# EAGLE design r8_ATMega328 (EAGLE 7.4.0)
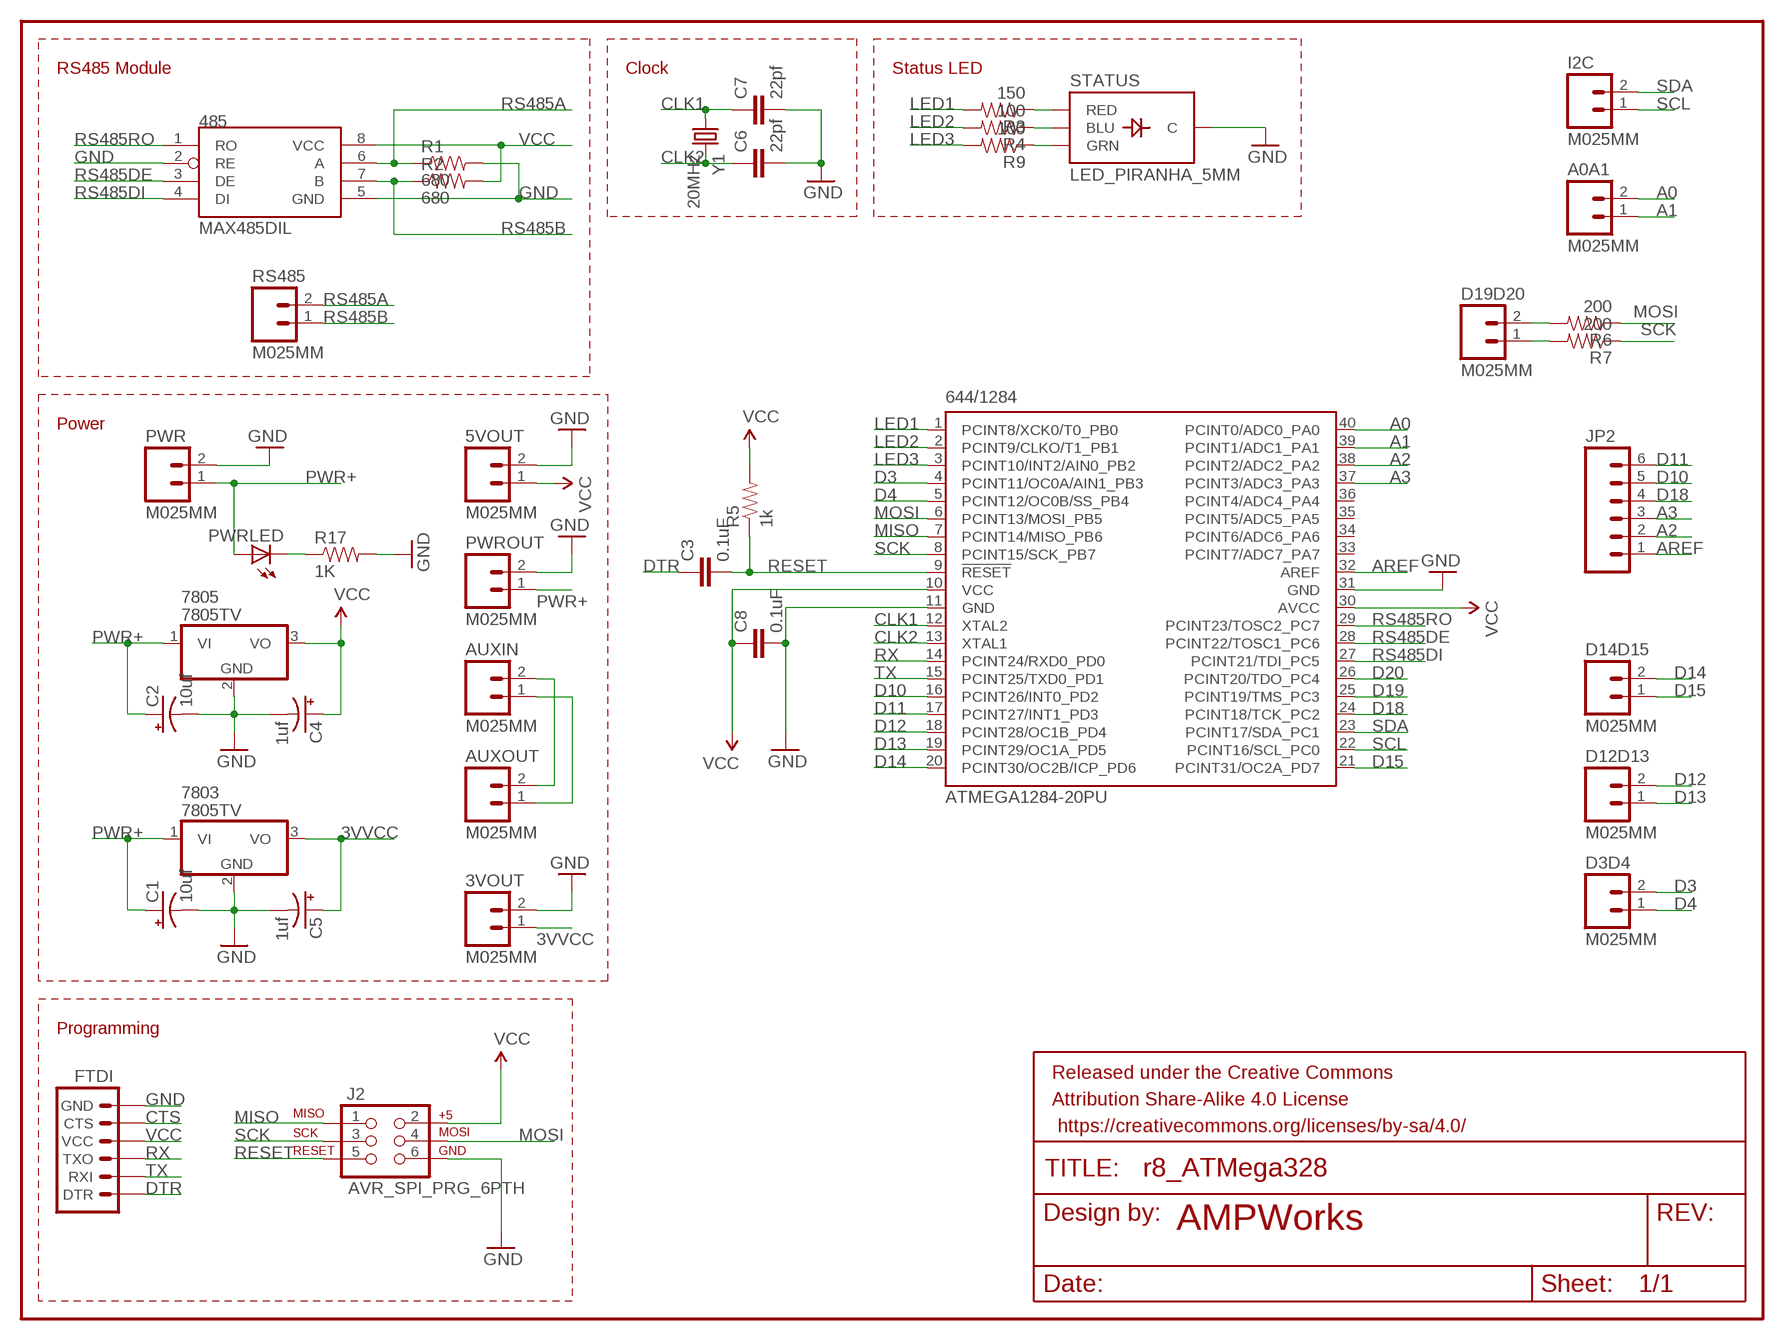
[diagram p0: schematic, sheet 1]

## Parts
3VOUT  M025MM  [SCREWTERMINAL-5MM-2]
5VOUT  M025MM  [SCREWTERMINAL-5MM-2]
485  MAX485DIL  [DIL08]
644/1284  ATMEGA1284-20PU  ATMEGA644-20PU  [DIL40]
7803  7805TV  [TO220V]
7805  7805TV  [TO220V]
A0A1  M025MM  [SCREWTERMINAL-5MM-2]
AUXIN  M025MM  [SCREWTERMINAL-5MM-2]
AUXOUT  M025MM  [SCREWTERMINAL-5MM-2]
C1  10uf  CAP_POLPTH2  [CPOL-RADIAL-10UF-25V]
C2  10uf  CAP_POLPTH2  [CPOL-RADIAL-10UF-25V]
C3  0.1uF  CAPPTH  [CAP-PTH-SMALL]
C4  1uf  CAP_POLPTH2  [CPOL-RADIAL-10UF-25V]
C5  1uf  CAP_POLPTH2  [CPOL-RADIAL-10UF-25V]
C6  22pf  CAPPTH  [CAP-PTH-SMALL]
C7  22pf  CAPPTH  [CAP-PTH-SMALL]
C8  0.1uF  CAPPTH  [CAP-PTH-SMALL]
D3D4  M025MM  [SCREWTERMINAL-5MM-2]
D12D13  M025MM  [SCREWTERMINAL-5MM-2]
D14D15  M025MM  [SCREWTERMINAL-5MM-2]
D19D20  M025MM  [SCREWTERMINAL-5MM-2]
FRAME1  FRAME-LETTER  [CREATIVE_COMMONS]
FTDI  ARDUINO_SERIAL_PROGRAMPTH  [1X06]
I2C  M025MM  [SCREWTERMINAL-5MM-2]
J2  AVR_SPI_PRG_6PTH  [2X3]
JP2  M06NO_SILK  [1X06_NO_SILK]
PWR  M025MM  [SCREWTERMINAL-5MM-2]
PWRLED  LED5MM  [LED5MM]
PWROUT  M025MM  [SCREWTERMINAL-5MM-2]
R1  680  RESISTORPTH-1/4W  [AXIAL-0.4]
R2  680  RESISTORPTH-1/4W  [AXIAL-0.4]
R3  150  RESISTORPTH-1/4W  [AXIAL-0.4]
R4  100  RESISTORPTH-1/4W  [AXIAL-0.4]
R5  1k  RESISTORPTH-1/4W  [AXIAL-0.4]
R6  200  RESISTORPTH-1/4W  [AXIAL-0.4]
R7  200  RESISTORPTH-1/4W  [AXIAL-0.4]
R9  100  RESISTORPTH-1/4W  [AXIAL-0.4]
R17  1K  RESISTORPTH-1/4W  [AXIAL-0.4]
RS485  M025MM  [SCREWTERMINAL-5MM-2]
STATUS  LED_PIRANHA_5MM  [LED_PIRANHA_5MM]
Y1  20MHz  CRYSTALHC49US  [HC49US]

## Nets
3VVCC: 3VOUT.1 7803.3(VO) C5.1(+)
A0: 644/1284.40(PCINT0/ADC0_PA0) A0A1.2
A1: 644/1284.39(PCINT1/ADC1_PA1) A0A1.1
A2: 644/1284.38(PCINT2/ADC2_PA2) JP2.2
A3: 644/1284.37(PCINT3/ADC3_PA3) JP2.3
AREF: 644/1284.32(AREF) JP2.1
CLK1: 644/1284.12(XTAL2) C7.1 Y1.1
CLK2: 644/1284.13(XTAL1) C6.1 Y1.2
CTS: FTDI.CTS
D3: 644/1284.4(PCINT11/OC0A/AIN1_PB3) D3D4.2
D4: 644/1284.5(PCINT12/OC0B/SS_PB4) D3D4.1
D10: 644/1284.16(PCINT26/INT0_PD2) JP2.5
D11: 644/1284.17(PCINT27/INT1_PD3) JP2.6
D12: 644/1284.18(PCINT28/OC1B_PD4) D12D13.2
D13: 644/1284.19(PCINT29/OC1A_PD5) D12D13.1
D14: 644/1284.20(PCINT30/OC2B/ICP_PD6) D14D15.2
D15: 644/1284.21(PCINT31/OC2A_PD7) D14D15.1
D18: 644/1284.24(PCINT18/TCK_PC2) JP2.4
D19: 644/1284.25(PCINT19/TMS_PC3)
D20: 644/1284.26(PCINT20/TDO_PC4)
DTR: C3.1 FTDI.DTR
GND: 3VOUT.2 5VOUT.2 485.2(RE) 485.5(GND) 644/1284.11(GND) 644/1284.31(GND) 7803.2(GND) 7805.2(GND) C1.2(-) C2.2(-) C4.2(-) C5.2(-) C6.2 C7.2 C8.2 FTDI.GND J2.6 PWR.2 PWROUT.2 R1.P$2 R17.P$2 STATUS.-(C)
LED1: 644/1284.1(PCINT8/XCK0/T0_PB0) R3.P$2
LED2: 644/1284.2(PCINT9/CLKO/T1_PB1) R4.P$2
LED3: 644/1284.3(PCINT10/INT2/AIN0_PB2) R9.P$2
MISO: 644/1284.7(PCINT14/MISO_PB6) J2.1
MOSI: 644/1284.6(PCINT13/MOSI_PB5) J2.4 R6.P$1
N$1: PWRLED.K(C) R17.P$1
N$2: AUXIN.1 AUXOUT.1
N$3: AUXIN.2 AUXOUT.2
N$4: D19D20.2 R6.P$2
N$5: R3.P$1 STATUS.R(RED)
N$6: R4.P$1 STATUS.B(BLU)
N$7: R9.P$1 STATUS.G(GRN)
N$8: D19D20.1 R7.P$2
PWR+: 7803.1(VI) 7805.1(VI) C1.1(+) C2.1(+) PWR.1 PWRLED.A PWROUT.1
RESET: 644/1284.9(!RESET) C3.2 J2.5 R5.P$1
RS485A: 485.6(A) R1.P$1 RS485.2
RS485B: 485.7(B) R2.P$1 RS485.1
RS485DE: 485.3(DE) 644/1284.28(PCINT22/TOSC1_PC6)
RS485DI: 485.4(DI) 644/1284.27(PCINT21/TDI_PC5)
RS485RO: 485.1(RO) 644/1284.29(PCINT23/TOSC2_PC7)
RX: 644/1284.14(PCINT24/RXD0_PD0) FTDI.TXO
SCK: 644/1284.8(PCINT15/SCK_PB7) J2.3 R7.P$1
SCL: 644/1284.22(PCINT16/SCL_PC0) I2C.1
SDA: 644/1284.23(PCINT17/SDA_PC1) I2C.2
TX: 644/1284.15(PCINT25/TXD0_PD1) FTDI.RXI
VCC: 5VOUT.1 485.8(VCC) 644/1284.10(VCC) 644/1284.30(AVCC) 7805.3(VO) C4.1(+) C8.1 FTDI.VCC J2.2 R2.P$2 R5.P$2
Unconnected: 644/1284.33(PCINT7/ADC7_PA7) 644/1284.34(PCINT6/ADC6_PA6) 644/1284.35(PCINT5/ADC5_PA5) 644/1284.36(PCINT4/ADC4_PA4)

## Notes on the sheet
- RS485 Module | Clock | Status LED
- Power
- Programming
- AMPWorks

## Library data of the parts
3VOUT 5VOUT A0A1 AUXIN AUXOUT D3D4 D12D13 D14D15 D19D20 I2C PWR PWROUT RS485 = SparkFun-Connectors:M02: Standard 2-pin 0.1" header. Use with - straight break away headers ( PRT-00116) - right angle break away headers (PRT-00553) - swiss pins (PRT-00743) - machine pins (PRT-00117) - female headers (PRT-00115) Molex polarized connector foot print use with: PRT-08233 with associated crimp pins and housings. 2.54_SCREWTERM for use with PRT-10571. 3.5mm Screw Terminal footprints for PRT-08084 5mm Screw Terminal footprints for use with PRT-08433
485 = SparkFun-DigitalIC:MAX485: RS-485 transceiver
644/1284 = atmel:ATMEGA644-*PU: 8-bit Microcontroller with 64K Bytes In-System Programmable Flash Auto generated by make-symbol-device-package-bsdl.ulp Rev. 34 Source: http://www.atmel.com/dyn/resources/prod_documents/doc2593.pdf; MPN: ATMEGA644-20PU; OC_FARNELL: 1288340; OC_NEWARK: 23M5060
7803 7805 = linear:78*: Positive VOLTAGE REGULATOR Source: http://cache.national.com/ds/LM/LM78L05.pdf http://www.fairchildsemi.com/ds/LM/LM7805.pdf
C1 C2 C4 C5 = SparkFun-Capacitors:CAP_POL: Capacitor Polarized These are standard SMD and PTH capacitors. Normally 10uF, 47uF, and 100uF in electrolytic and tantalum varieties. Always verify the external diameter of the through hole cap, it varies with capacity, voltage, and manufacturer. The EIA devices should be standard.
C3 C6-C8 = SparkFun-Capacitors:CAP: Capacitor Standard 0603 ceramic capacitor, and 0.1" leaded capacitor.
FRAME1 = SparkFun-Aesthetics:FRAME-LETTER: Schematic Frame Standard 8.5x11 US Letter frame
FTDI = SparkFun-Connectors:ARDUINO_SERIAL_PROGRAM: FTDI connector footprints
J2 = SparkFun-Connectors:AVR_SPI_PRG_6: AVR ISP 6 Pin This is the reduced ISP connector for AVR programming. Common on Arduino. This footprint will take up less PCB space and can be used with a 10-pin to 6-pin adapter such as SKU: BOB-08508
JP2 = SparkFun-Connectors:M06: Header 6 Standard 6-pin 0.1" header. Use with straight break away headers (SKU : PRT-00116), right angle break away headers (PRT-00553), swiss pins (PRT-00743), machine pins (PRT-00117), and female headers (PRT-00115). Molex polarized connector foot print use with SKU : PRT-08094 with associated crimp pins and housings. NOTES ON THE VARIANTS LOCK and LOCK_LONGPADS... This footprint was designed to help hold the alignment of a through-hole component (i.e. 6-pin header) while soldering it into place. You may notice that each hole has been shifted either up or down by 0.005 of an inch from it's more standard position (which is a perfectly straight line). This slight alteration caused the pins (the squares in the middle) to touch the edges of the holes. Because they are alternating, it causes a "brace" to hold the component in place. 0.005 has proven to be the perfect amount of "off-center" position when using our standard breakaway headers. Although looks a little odd when you look at the bare footprint, once you have a header in there, the alteration is very hard to notice. Also,if you push a header all the way into place, it is covered up entirely on the bottom side. This idea of altering the position of holes to aid alignment will be further integrated into the Sparkfun Library for other footprints. It can help hold any component with 3 or more connection pins.
PWRLED = SparkFun-LED:LED: LEDs Standard schematic elements and footprints for 5mm, 3mm, 1206, and 0603 sized LEDs. 5mm - Spark Fun Electronics SKU : COM-00529 (and others)
R1 R2 R17 = SparkFun-Resistors:RESISTOR: Resistor Basic schematic elements and footprints for 0603, 1206, and PTH resistors.
R3-R7 R9 = SparkFun-Passives:RESISTOR: Resistor Basic schematic elements and footprints for 0603, 1206, and PTH resistors.
STATUS = SparkFun-LED:LED_PIRANHA_5MM: High-brightness RGB through-hole LED, similar to that used in the Shiftbrite
Y1 = SparkFun-FreqCtrl:CRYSTAL: Various standard crystals. Proven footprints. Spark Fun Electronics SKU : COM-00534

## Board
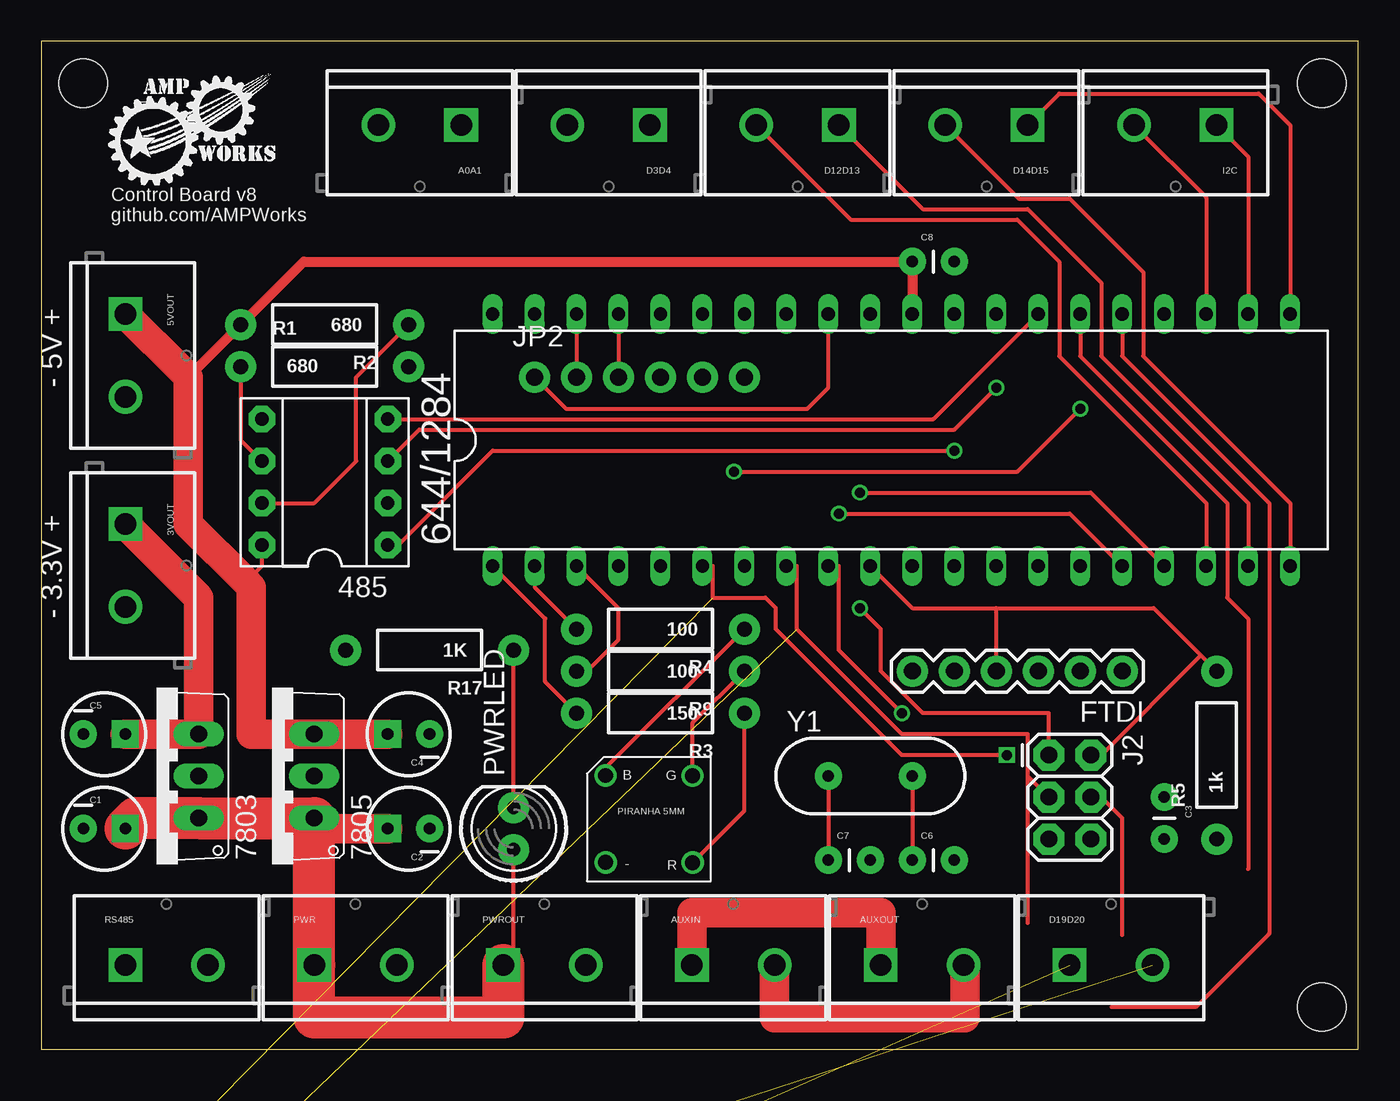
[diagram p1: board, top side]
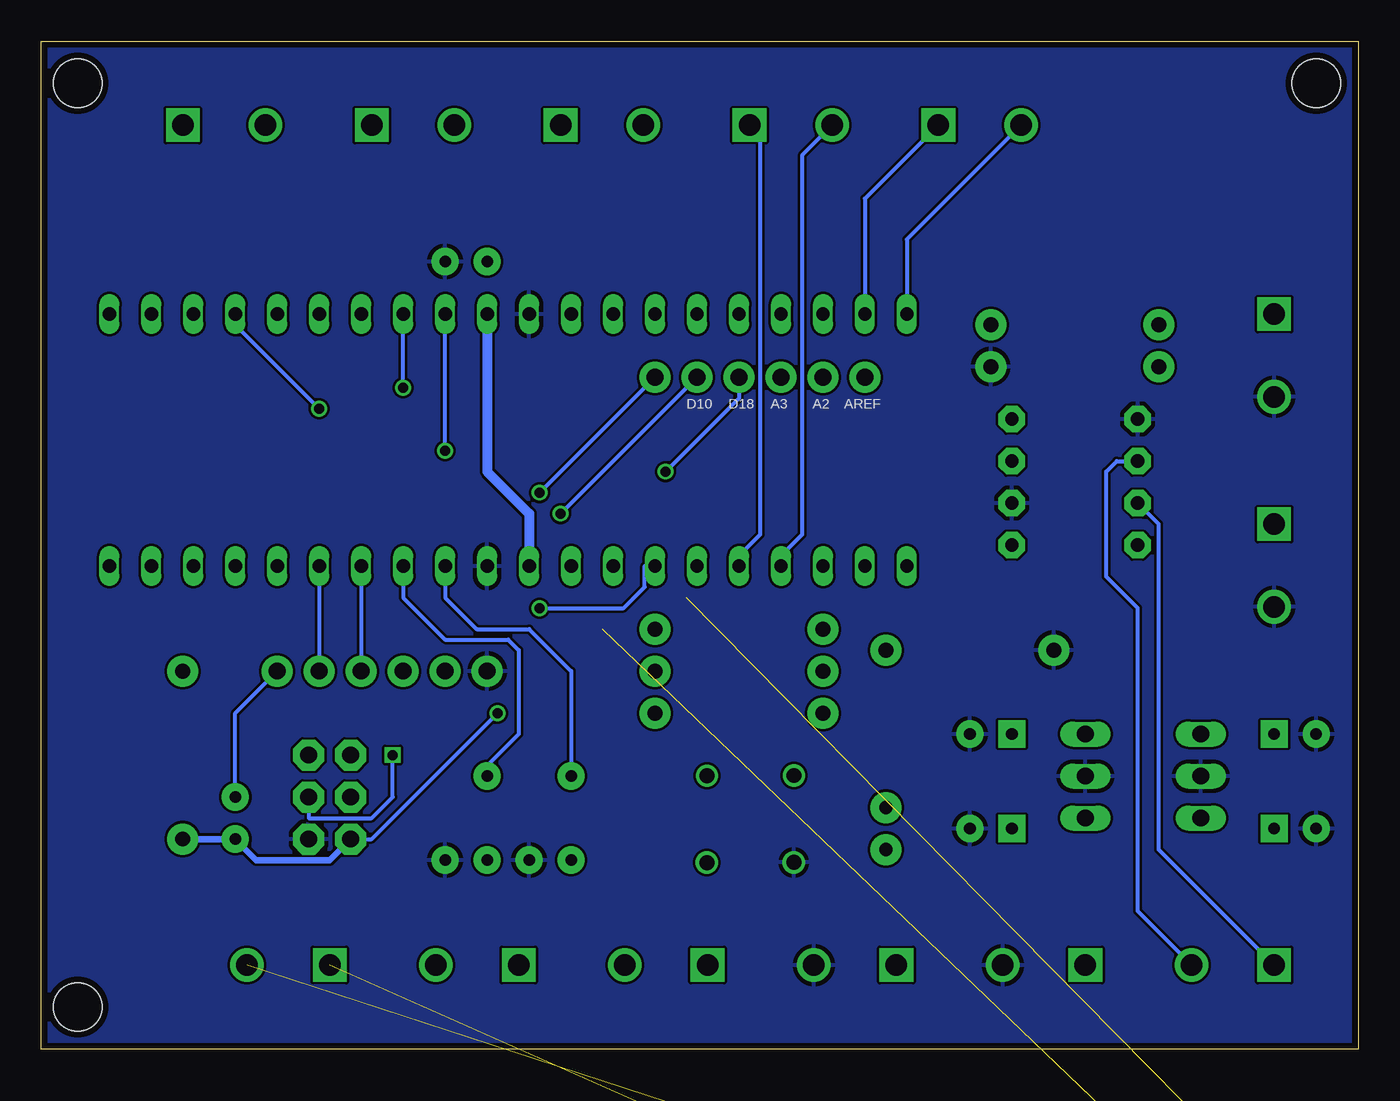
[diagram p2: board, bottom side, seen from below]

Size 79.68 x 60.95 mm. Coordinates in mm from the lower left corner, seen from the top.
Outline: 0,0 79.68,0 79.68,60.95 0,60.95 0,0
Copper layers (1*16): Top 0.0356mm / dielectric 1.5011mm / Bottom 0.0356mm
Design rules "OSHParkDesignRules": minimum track width 6mil, minimum drill 13mil, track to track 6mil, track to pad 6mil, pad to pad 6mil, via to via 6mil, smd to smd 6mil, copper to edge 15mil, drill to drill 6mil, minimum pad ring 7mil, minimum via ring 7mil, stop-mask expansion 3mil, vias tented up to drill 0mil, thermal gap 10mil
Holes 2.92 mm at 2.54,58.42 77.47,58.42 77.47,2.54

### Footprints (pad centres in the part's own frame; a part is rotated, then mirrored left to right if it is on the bottom)
SCREWTERMINAL-5MM-2 = drill 1.3 pad 2.032 square: 1 0,0 | drill 1.3 pad 2.032: 2 5,0
DIL08 = drill 0.813 pad 1.6 octagon: 1 -3.81,-3.81; 2 -1.27,-3.81; 3 1.27,-3.81; 4 3.81,-3.81; 5 3.81,3.81; 6 1.27,3.81; 7 -1.27,3.81; 8 -3.81,3.81
DIL40 = drill 0.813 long: 1 -24.13,-7.62; 2 -21.59,-7.62; 3 -19.05,-7.62; 4 -16.51,-7.62; 5 -13.97,-7.62; 6 -11.43,-7.62; 7 -8.89,-7.62; 8 -6.35,-7.62; 9 -3.81,-7.62; 10 -1.27,-7.62; 11 1.27,-7.62; 12 3.81,-7.62; 13 6.35,-7.62; 14 8.89,-7.62; 15 11.43,-7.62; 16 13.97,-7.62; 17 16.51,-7.62; 18 19.05,-7.62; 19 21.59,-7.62; 20 24.13,-7.62; 21 24.13,7.62; 22 21.59,7.62; 23 19.05,7.62; 24 16.51,7.62; 25 13.97,7.62; 26 11.43,7.62; 27 8.89,7.62; 28 6.35,7.62; 29 3.81,7.62; 30 1.27,7.62; 31 -1.27,7.62; 32 -3.81,7.62; 33 -6.35,7.62; 34 -8.89,7.62; 35 -11.43,7.62; 36 -13.97,7.62; 37 -16.51,7.62; 38 -19.05,7.62; 39 -21.59,7.62; 40 -24.13,7.62
TO220V = drill 1.016 long: 1 -2.54,-2.54; 2 0,-2.54; 3 2.54,-2.54
CPOL-RADIAL-10UF-25V = drill 0.7 pad 1.651 square: 1 1.27,0 | drill 0.7 pad 1.651: 2 -1.27,0
CAP-PTH-SMALL = drill 0.7 pad 1.651: 1 0,0; 2 2.54,0
1X06 = drill 1.016 pad 1.88: CTS 10.16,0; DTR 0,0; GND 12.7,0; RXI 2.54,0; TXO 5.08,0; VCC 7.62,0
2X3 = drill 1.016 pad 1.88 octagon: 1 0,0; 2 0,2.54; 3 2.54,0; 4 2.54,2.54; 5 5.08,0; 6 5.08,2.54
1X06_NO_SILK = drill 1.016 pad 1.88: 1 0,0; 2 2.54,0; 3 5.08,0; 4 7.62,0; 5 10.16,0; 6 12.7,0
LED5MM = drill 0.813 pad 1.88: A -1.27,0; K 1.27,0
AXIAL-0.4 = drill 0.9 pad 1.88: P$1 -5.08,0; P$2 5.08,0
LED_PIRANHA_5MM = drill 0.9: - -2.684,-2.684; B -2.688,2.574; G 2.575,2.562; R 2.579,-2.696
HC49US = drill 0.7 pad 1.651: 1 -2.54,0; 2 2.54,0

### Placement (x,y rotation side)
3VOUT  5.08,31.75 270 top
5VOUT  5.08,44.45 270 top
485  17.14,34.29 90 top
644/1284  51.44,36.83 0 top
7803  6.99,16.51 90 top
7805  13.97,16.51 90 top
A0A1  25.4,55.88 180 top
AUXIN  39.37,5.08 0 top
AUXOUT  50.8,5.08 0 top
C1  3.81,13.34 0 top
C2  22.23,13.34 180 top
C3  67.94,15.24 270 top
C4  22.23,19.05 180 top
C5  3.81,19.05 0 top
C6  52.7,11.43 0 top
C7  47.62,11.43 0 top
C8  52.7,47.62 0 top
D3D4  36.83,55.88 180 top
D12D13  48.26,55.88 180 top
D14D15  59.69,55.88 180 top
D19D20  62.23,5.08 0 top
FRAME1  21.59,-8.89 0 top  (outside the outline)
FTDI  65.41,22.86 180 top
I2C  71.12,55.88 180 top
J2  60.96,17.78 270 top
JP2  29.84,40.64 0 top
PWR  16.51,5.08 0 top
PWRLED  28.57,13.34 90 top
PWROUT  27.94,5.08 0 top
R1  17.14,41.27 0 top
R2  17.14,43.81 180 top
R3  37.47,20.32 180 top
R4  37.47,25.4 180 top
R5  71.12,17.78 90 top
R6  5.71,-13.34 0 top  (outside the outline)
R7  5.71,-17.78 0 top  (outside the outline)
R9  37.47,22.86 180 top
R17  23.5,24.13 180 top
RS485  5.08,5.08 0 top
STATUS  36.83,13.97 0 top
Y1  50.16,16.51 0 top

### Tracks (layer width: path | path; a pad name or v marks a point on that pad's centre or on a via)
3VVCC
  Top 1.778: C5.1 7803.3 9.53,27.3 3VOUT.1
A0
  Bottom 0.254: A0A1.2 27.3,48.98 644/1284.40
A1
  Bottom 0.254: A0A1.1 29.84,51.44 644/1284.39
A2
  Top 0.254: 644/1284.38 JP2.2
A3
  Top 0.254: 644/1284.37 JP2.3
AREF
  Top 0.254: JP2.1 31.75,38.73 46.35,38.73 47.62,40.01 644/1284.32
CLK1
  Top 0.254: Y1.1 C7.1
  Bottom 0.254: 644/1284.12 55.24,27.3 53.34,25.4 50.16,25.4 47.62,22.86 Y1.1
CLK2
  Top 0.254: Y1.2 C6.1
  Bottom 0.254: 644/1284.13 57.78,27.3 55.24,24.77 51.44,24.77 50.8,24.13 50.8,19.05 52.7,17.14 Y1.2
D3
  Bottom 0.254: D3D4.2 33.66,54.05 33.66,31.11 34.92,29.84 644/1284.4
D4
  Bottom 0.254: D3D4.1 36.2,55.24 36.2,31.11 37.47,29.84 644/1284.5
D10  (via drill 0.6)
  Top 0.254: v48.26,32.38 62.23,32.38 644/1284.16
  Bottom 0.254: JP2.5 v48.26,32.38
D11  (via drill 0.6)
  Top 0.254: v49.53,33.66 63.5,33.66 644/1284.17
  Bottom 0.254: JP2.6 v49.53,33.66
D12
  Top 0.254: D12D13.2 48.98,50.16 59.05,50.16 61.59,47.62 61.59,41.91 70.48,33.02 644/1284.18
D13
  Top 0.254: D12D13.1 53.34,50.8 59.69,50.8 64.14,46.35 64.14,41.91 73.03,33.02 644/1284.19
D14
  Top 0.254: D14D15.2 59.13,51.44 62.23,51.44 66.67,46.99 66.67,41.91 75.56,33.02 644/1284.20
D15
  Top 0.254: D14D15.1 61.59,57.78 73.66,57.78 75.56,55.88 644/1284.21
D18  (via drill 0.6)
  Top 0.254: v41.91,34.92 59.05,34.92 v62.87,38.73
  Bottom 0.254: JP2.4 37.47,39.37 v41.91,34.92 | v62.87,38.73 67.94,43.81 644/1284.24
D19
  Top 0.254: 644/1284.25 65.41,41.91 74.3,33.02 74.3,6.99 69.85,2.54 64.77,2.54
D20
  Top 0.254: 644/1284.26 62.87,41.91 71.75,33.02 71.75,27.3 73.03,26.04 73.03,10.88
DTR
  Bottom 0.254: C3.1 67.94,20.32 FTDI.DTR
GND
  pour Bottom: 0,60.96 79.38,60.96 79.38,0 0,0
LED1
  Top 0.254: R3.P$2 30.48,22.23 30.48,26.04 644/1284.1
LED2
  Top 0.254: 644/1284.2 29.84,27.94 R4.P$2
LED3
  Top 0.254: R9.P$2 33.02,22.86 34.92,24.77 34.92,26.67 644/1284.3
MISO  (via drill 0.61)
  Top 0.254: v49.53,26.67 50.8,25.4 50.8,22.86 53.34,20.32 60.96,20.32 J2.1
  Bottom 0.254: v49.53,26.67 44.45,26.67 43.18,27.94 43.18,29.21 644/1284.7
MOSI  (via drill 0.6)  (1 unrouted)
  Top 0.254: v58.42,17.78 52.07,17.78 44.45,25.4 44.45,26.67 43.81,27.3 40.64,27.3 40.64,29.21 644/1284.6 | 65.41,6.91 65.41,13.97 64.14,15.24 J2.4
  Bottom 0.254: v58.42,17.78 58.42,15.24 59.69,13.97 63.5,13.97 J2.4
N$1
  Top 0.254: PWRLED.K R17.P$1
N$2
  Top 1.778: AUXIN.1 39.37,8.26 50.8,8.26 AUXOUT.1
N$3
  Top 1.778: AUXIN.2 44.37,1.91 55.88,1.91 55.88,5.08 AUXOUT.2
N$4  (1 unrouted)
N$5
  Top 0.254: STATUS.R 42.55,14.41 R3.P$1
N$6
  Top 0.254: STATUS.B 34.14,17 R4.P$1
N$7
  Top 0.254: STATUS.G 39.41,19.72 R9.P$1
N$8  (1 unrouted)
PWR+
  Top 0.254: PWROUT.1 28.57,5.71 PWRLED.A
  Top 1.778: C2.1 17.14,13.34 7805.1
  Top 2.54: PWROUT.1 27.94,1.91 16.51,1.91 PWR.1 7805.1 7803.1 5.71,13.97 C1.1
RESET  (via drill 0.61)
  Top 0.254: v52.07,20.32 48.26,24.13 48.26,29.21 644/1284.9
  Bottom 0.254: v52.07,20.32 59.69,12.7 J2.5
  Bottom 0.406: J2.5 62.23,11.43 66.67,11.43 C3.2 R5.P$1
RS485A
  Top 0.254: R1.P$1 12.06,36.83 485.6
  Bottom 0.254: RS485.2 13.34,8.34 13.34,26.67 15.24,28.57 15.24,34.92 14.61,35.56 485.6
RS485B
  Top 0.254: 485.7 16.51,33.02 19.05,35.56 19.05,40.64 R2.P$1
  Bottom 0.254: RS485.1 12.06,12.06 12.06,31.75 485.7
RS485DE  (via drill 0.6)
  Top 0.254: 485.3 22.86,37.47 55.24,37.47 v57.78,40.01
  Bottom 0.254: v57.78,40.01 644/1284.28
RS485DI
  Top 0.254: 485.4 53.98,38.1 644/1284.27
RS485RO  (via drill 0.6)
  Top 0.254: 485.1 21.59,30.48 27.3,36.2 v55.24,36.2
  Bottom 0.254: v55.24,36.2 644/1284.29
RX
  Bottom 0.254: 644/1284.14 FTDI.TXO
SCK  (1 unrouted)
  Top 0.254: 59.69,16.51 59.69,19.05 52.07,19.05 45.72,25.4 45.72,29.21 644/1284.8 | J2.3 59.69,16.51 | 59.69,7.62 59.69,16.51
SCL
  Top 0.254: I2C.1 73.03,53.98 644/1284.22
SDA
  Top 0.254: I2C.2 70.48,51.52 644/1284.23
TX
  Bottom 0.254: 644/1284.15 FTDI.RXI
VCC
  Top 0.254: 485.8 13.34,29.21 12.38,28.26 | 644/1284.10 52.7,26.67 57.78,26.67 | 57.78,26.67 67.31,26.67 70.17,23.81 | 70.17,23.81 R5.P$2 | J2.2 64.14,17.78 70.17,23.81 | FTDI.VCC 57.78,26.67
  Top 0.61: 644/1284.30 C8.1 15.88,47.62 R2.P$2 9.21,40.96 8.57,40.96
  Top 1.778: C4.1 7805.3 12.7,19.05 12.7,27.94 12.38,28.26 8.89,31.75 8.89,40.64 8.57,40.96 5VOUT.1
  Bottom 0.61: 644/1284.30 52.7,34.92 50.16,32.38 644/1284.10

### Text on the board
tPlace: Control Board v8 | github.com/AMPWorks | - 5V + | - 3.3V +
bPlace: AREF | A2 | A3 | D18 | D10